# Altium schematic sheet USBC.schdoc
size 57 x 68 mm
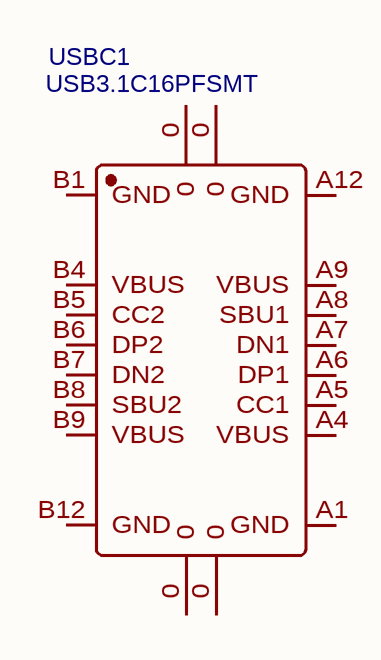
[diagram p0: USBC.schdoc]

## Parts
USBC1  USB3.1C16PFSMT  [USB-C-SMD_TYPE-C-USB-17]

## Nets

Not connected (* = marked no-connect by the designer): USBC1 0 A1(GND) A4(VBUS) A5(CC1) A6(DP1) A7(DN1) A8(SBU1) A9(VBUS) A12(GND) B1(GND) B4(VBUS) B5(CC2) B6(DP2) B7(DN2) B8(SBU2) B9(VBUS) B12(GND)

## Library data of the parts
USBC1 = USB3.1C16PFSMT: BOM_Manufacturer: LCSC; BOM_Supplier: LCSC; BOM_Supplier Part: C167321; BOM_Manufacturer Part: -; Contributor: LCSC; spicePre: U; spiceSymbolName: USB3.1C16PFSMT